# EAGLE board hh2019_proto (EAGLE 9.2.2)
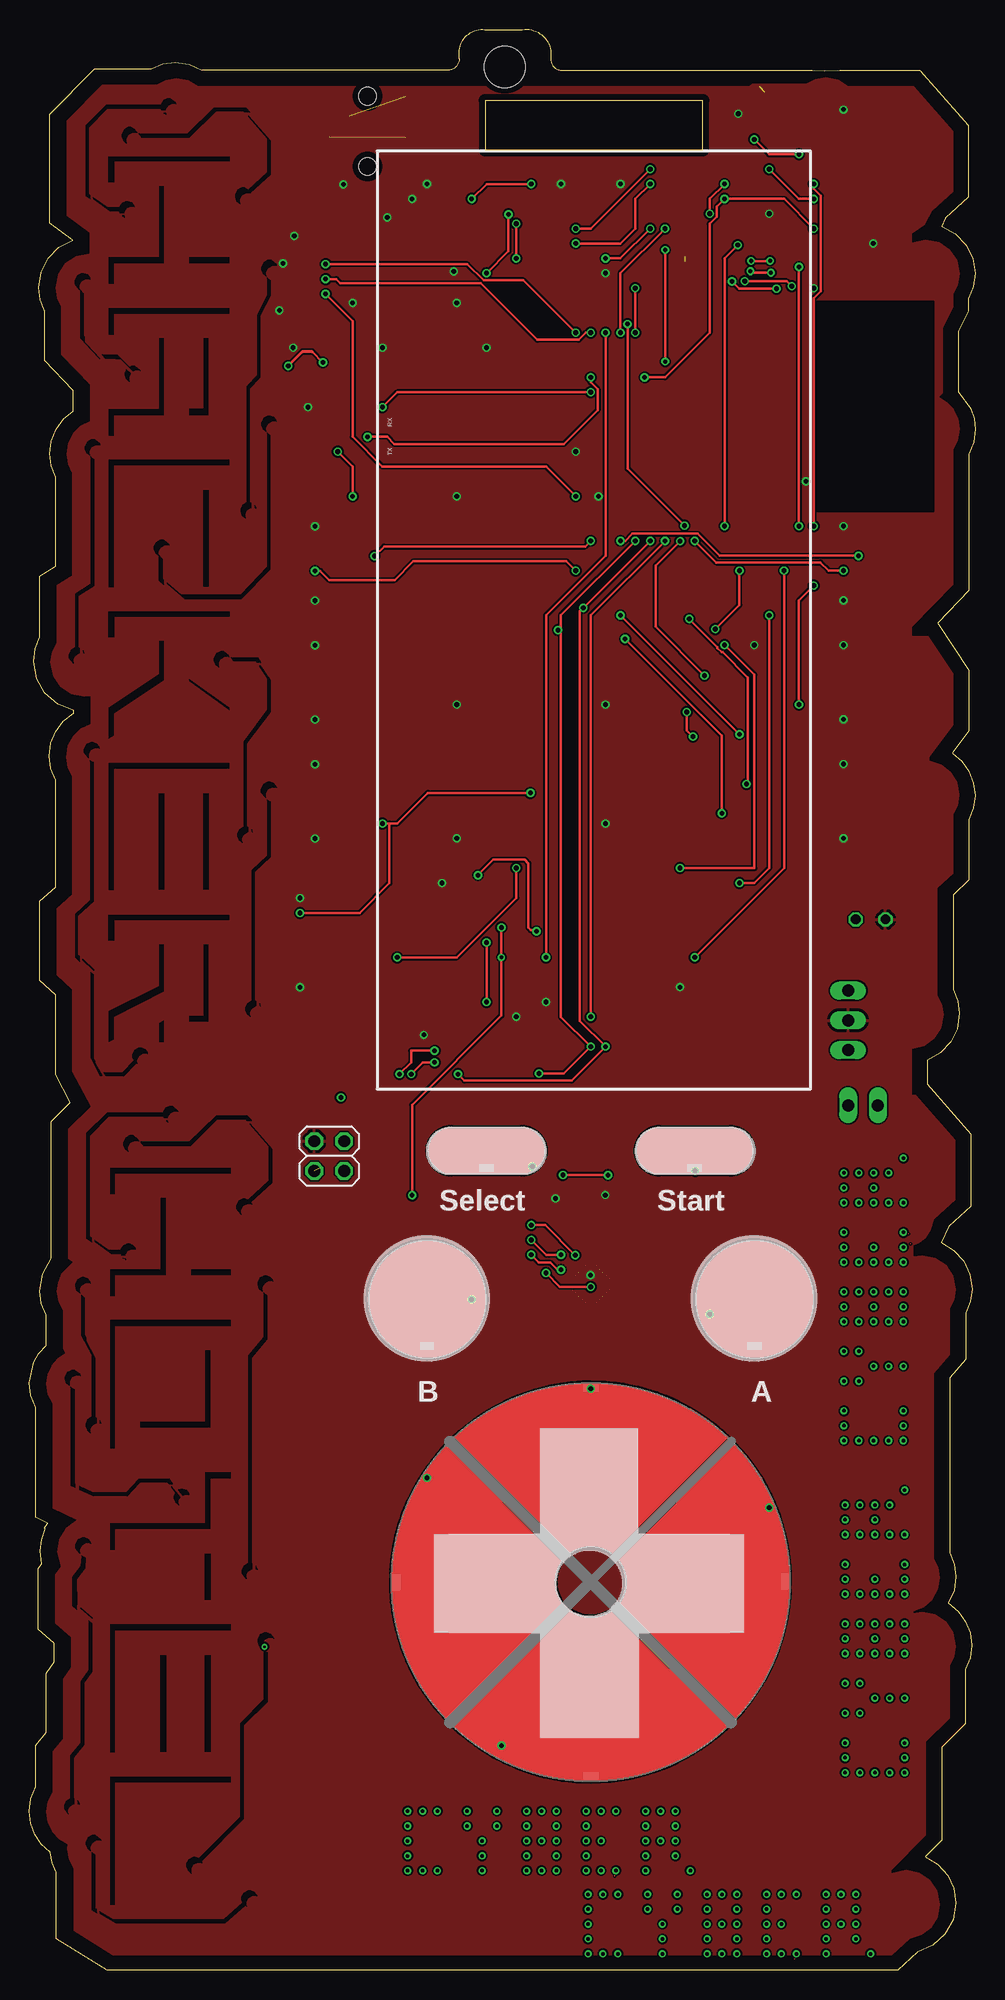
[diagram p3: board, top side]
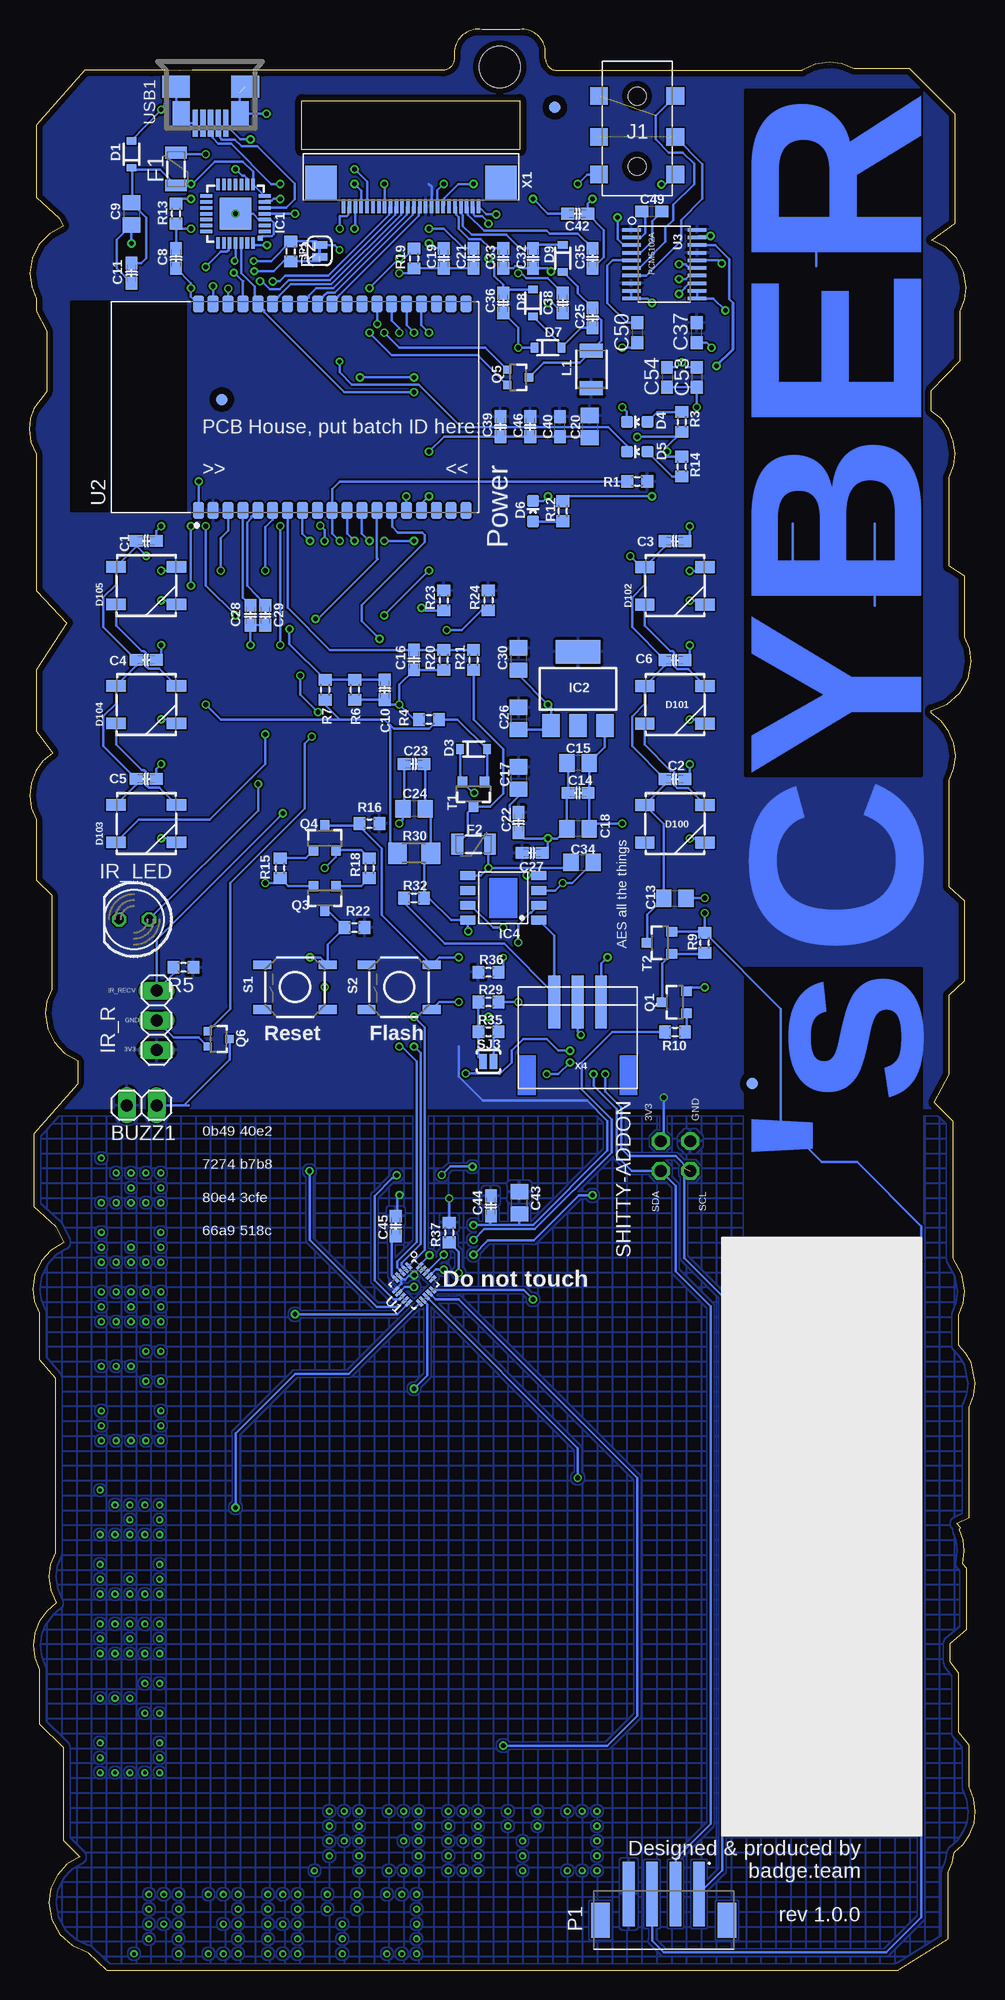
[diagram p4: board, bottom side, seen from below]

Size 80.77 x 165.74 mm. Coordinates in mm from the lower left corner, seen from the top.
Outline: 178 segments
Copper layers (1*16): Top 0.035mm / dielectric 1.6mm / Bottom 0.035mm
Design rules "Elecrow_2-layer_PCB_eagle_rule": minimum track width 6mil, minimum drill 12mil, track to track 6mil, track to pad 6mil, pad to pad 6mil, via to via 8mil, smd to smd 0mil, copper to edge 20mil, drill to drill 10mil, minimum pad ring 6mil, minimum via ring 6mil, stop-mask expansion 0mil, vias tented up to drill 100mil, thermal gap 10mil
Net classes: 1 FAT: width 0.2 mm, drill 0.4 mm; 2 GND/3V3: width 0.2 mm, drill 0.4 mm; 3 Touch: width 0.2 mm, clearance 1 mm; 4 touch prox: width 0.2 mm, clearance 1.6 mm
Holes 3.5 mm at 40.6,162.52
tRestrict: area 67.2,124.6 to 77.2,142.5; area 11.1,92.3 to 11.5,100.5; area 4.8,151.3 to 12.5,159.8; area 7.9,156 to 9.2,157.4; area 9.4,156.5 to 18.8,159.1; area 17.6,150.9 to 20.6,158.3; area 6.8,152.7 to 17.1,154.9; area 6.8,144.1 to 11.5,152.3; area 5.5,150.1 to 9,151.4; area 13.7,145.8 to 17.1,146.2; area 6.8,139.7 to 17.1,141.9; area 3.9,143.5 to 5.2,144.9; 69 more areas; 63 lines
bRestrict: area 67.4,124.6 to 77.2,142.5

## Footprints (pad centres in the part's own frame; a part is rotated, then mirrored left to right if it is on the bottom)
1X02 = drill 1.016 long: 1 -1.27,0; 2 1.27,0
C0603-DASHES = smd 1.1 x 1: 1 -0.85,0; 2 0.85,0
C0805 = smd 1.3 x 1.5: 1 -0.95,0; 2 0.95,0
C0603 = smd 1.1 x 1: 1 -0.85,0; 2 0.85,0
SOD-323 = smd 0.63 x 0.83: A 1.15,0; C -1.15,0
LED-0603 = smd 1 x 1: A 0,-0.877; C 0,0.877
WS2812B = smd 1.651 x 1: 1 -2.577,1.6; 2 -2.577,-1.6; 3 2.577,-1.6; 4 2.577,1.6
PTC-1206 = smd 1 x 1.8: 1 -1.4,0; 2 1.4,0
FIDUCIAL_1MM = smd 1 x 1: 1 0,0
MLP28 = smd 1 x 0.3: 1 -2.5,1.5; 2 -2.5,1; 3 -2.5,0.5; 4 -2.5,0; 5 -2.5,-0.5; 6 -2.5,-1; 7 -2.5,-1.5; 15 2.5,-1.5; 16 2.5,-1; 17 2.5,-0.5; 18 2.5,0; 19 2.5,0.5; 20 2.5,1; 21 2.5,1.5 | smd 0.3 x 1: 8 -1.5,-2.5; 9 -1,-2.5; 10 -0.5,-2.5; 11 0,-2.5; 12 0.5,-2.5; 13 1,-2.5; 14 1.5,-2.5; 22 1.5,2.5; 23 1,2.5; 24 0.5,2.5; 25 0,2.5; 26 -0.5,2.5; 27 -1,2.5; 28 -1.5,2.5 | smd 2.7 x 2.7: EXP 0,0 | smd 0.435 x 0.435: M -2.103,2.103
SOT223 = smd 1.5 x 2: 1 -2.3,-3.15; 2 0,-3.15; 3 2.3,-3.15 | smd 3.8 x 2: 4 0,3.15
SOP-8 = smd 1.27 x 0.76: 1 -3.035,1.905; 2 -3.035,0.635; 3 -3.035,-0.635; 4 -3.035,-1.905; 5 3.035,-1.905; 6 3.035,-0.635; 7 3.035,0.635; 8 3.035,1.905
LED5MM = drill 0.813 octagon: A -1.27,0; K 1.27,0
1X03 = drill 1.016 long: 1 -2.54,0; 2 0,0; 3 2.54,0
PJ-313D = smd 1.5 x 1.5: 2_1 0,3.25; 2_2 0,-3.25; 3_1 3.2,3.25; 3_2 3.22,-3.25; 4_1 6.7,3.25; 4_2 6.7,-3.25 | hole 1.5: 0.7,0; 6.7,0
SMT-JUMPER_2_NC_TRACE_SILK = smd 0.635 x 1.27: 1 -0.508,0; 2 0.508,0
1210 = smd 1.2 x 2: 1 -1.6,0; 2 1.6,0
JST_B4B-PH-SM4-TB = smd 1 x 5.5: 1 -3,0; 2 -1,0; 3 1,0; 4 3,0 | smd 1.6 x 3: P1 -5.4,2.25; P2 5.4,2.25
SOT23-3 = smd 0.8 x 0.9: 1 -0.95,-1; 2 0.95,-1; 3 0,1.1
SOT323 = smd 0.7 x 0.7: 1 -0.65,-0.925; 2 0.65,-0.925; 3 0,0.925
R0603-DASHES = smd 1 x 1.1: 1 -0.85,0; 2 0.85,0
R1206 = smd 1.6 x 1.803: 1 -1.422,0; 2 1.422,0
TACTILE-SWITCH-SMD = smd 1.524 x 0.762: 1 -2.794,1.905; 2 2.794,1.905; 3 -2.794,-1.905; 4 2.794,-1.905
2X02 = drill 1.016 octagon: 1 -1.27,-1.27; 2 -1.27,1.27; 3 1.27,-1.27; 4 1.27,1.27
PAD-JUMPER-2-NO_YES_SILK = smd 0.635 x 1.27: 1 -0.45,0; 2 0.45,0
TOUCH_BUTTON = smd 1.27 x 0.635: P$1 0,-4
TOUCH_CROSS = smd 1.27 x 0.635: D 0.03,-16.57; UP 0.02,16.6 | smd 0.635 x 1.27: L -16.59,-0.02; R 16.6,0.06
TOUCH_SELECT = smd 1.27 x 0.635: P$1 0,-1.5
QFN40P300X300X60-20N = smd 0.711 x 0.254: 1 -1.448,0.787; 2 -1.448,0.406; 3 -1.448,0; 4 -1.448,-0.406; 5 -1.448,-0.787; 11 1.448,-0.787; 12 1.448,-0.406; 13 1.448,0; 14 1.448,0.406; 15 1.448,0.787 | smd 0.254 x 0.711: 6 -0.787,-1.448; 7 -0.406,-1.448; 8 0,-1.448; 9 0.406,-1.448; 10 0.787,-1.448; 16 0.787,1.448; 17 0.406,1.448; 18 0,1.448; 19 -0.406,1.448; 20 -0.787,1.448
XCVR_ESP32-WROVER-I = smd 1.45 x 0.93: 1 -8.81,8.26; 2 -8.81,6.99; 3 -8.81,5.72; 4 -8.81,4.45; 5 -8.81,3.18; 6 -8.81,1.91; 7 -8.81,0.64; 8 -8.81,-0.63; 9 -8.81,-1.9; 10 -8.81,-3.17; 11 -8.81,-4.44; 12 -8.81,-5.71; 13 -8.81,-6.98; 14 -8.81,-8.25; 15 -8.81,-9.52; 16 -8.81,-10.79; 17 -8.81,-12.06; 18 -8.81,-13.33; 19 -8.81,-14.6; 20 8.81,-14.6; 21 8.81,-13.33; 22 8.81,-12.06; 23 8.81,-10.79; 24 8.81,-9.52; 25 8.81,-8.25; 26 8.81,-6.98; 27 8.81,-5.71; 28 8.81,-4.44; 29 8.81,-3.17; 30 8.81,-1.9; 31 8.81,-0.63; 32 8.81,0.64; 33 8.81,1.91; 34 8.81,3.18; 35 8.81,4.45; 36 8.81,5.72; 37 8.81,6.99; 38 8.81,8.26
PCM5102A = smd 0.3 x 1.6: P$1 -2.925,-2.8; P$2 -2.275,-2.8; P$3 -1.625,-2.8; P$4 -0.975,-2.8; P$5 -0.325,-2.8; P$6 0.325,-2.8; P$7 0.975,-2.8; P$8 1.625,-2.8; P$9 2.275,-2.8; P$10 2.925,-2.8; P$11 2.925,2.8; P$12 2.275,2.8; P$13 1.625,2.8; P$14 0.975,2.8; P$15 0.325,2.8; P$16 -0.325,2.8; P$17 -0.975,2.8; P$18 -1.625,2.8; P$19 -2.275,2.8; P$20 -2.927,2.8
MOLEX-47364-0001 = smd 2.3 x 0.45: 1 3.1,1.3; 2 3.1,0.65; 3 3.1,0; 4 3.1,-0.65; 5 3.1,-1.3 | smd 1.9 x 2.375: GND1 0,2.95; GND4 0,-2.95 | smd 2.1 x 1.475: GND2 2.3,2.5; GND3 2.3,-2.5
68712414022 = smd 0.3 x 1.2: 1 -5.75,0.6; 2 -5.25,0.6; 3 -4.75,0.6; 4 -4.25,0.6; 5 -3.75,0.6; 6 -3.25,0.6; 7 -2.75,0.6; 8 -2.25,0.6; 9 -1.75,0.6; 10 -1.25,0.6; 11 -0.75,0.6; 12 -0.25,0.6; 13 0.25,0.6; 14 0.75,0.6; 15 1.25,0.6; 16 1.75,0.6; 17 2.25,0.6; 18 2.75,0.6; 19 3.25,0.6; 20 3.75,0.6; 21 4.25,0.6; 22 4.75,0.6; 23 5.25,0.6; 24 5.75,0.6 | smd 2.7 x 3: 25 -7.68,-1.38; 26 7.68,-1.38
JST-PH3 = smd 1 x 4.5: 1 2,0; 2 0,0; 3 -2,0

## Placement (x,y rotation side)
BUZZ1  [1X02]  71.18,73.86 180 bottom
C1  100n  [C0603-DASHES]  70.79,122.05 180 bottom
C2  100n  [C0603-DASHES]  25.66,101.71 180 bottom
C3  100n  [C0603-DASHES]  25.66,122.03 180 bottom
C4  100n  [C0603-DASHES]  70.79,111.89 180 bottom
C5  100n  [C0603-DASHES]  70.79,101.73 180 bottom
C6  100n  [C0603-DASHES]  25.66,111.87 180 bottom
C8  100n  [C0603-DASHES]  68.25,146.18 270 bottom
C9  4u7/16V  [C0805]  72.06,149.99 270 bottom
C10  100n  [C0603-DASHES]  50.44,109.34 270 bottom
C11  100n  [C0603-DASHES]  72.06,144.91 270 bottom
C13  4u7/16V  [C0805]  25.66,91.55 0 bottom
C14  100n  [C0603-DASHES]  33.93,100.54 180 bottom
C15  4u7/16V  [C0805]  33.93,103.08 180 bottom
C16  100n  [C0603-DASHES]  47.93,111.89 270 bottom
C17  4u7/16V  [C0805]  39.01,101.81 270 bottom
C18  4u7/16V  [C0805]  33.93,97.46 180 bottom
C19  1u  [C0603-DASHES]  45.39,146.18 90 bottom
C20  4u7/16V  [C0805]  32.93,131.81 270 bottom
C21  1u  [C0603-DASHES]  42.85,146.18 90 bottom
C22  100n  [C0603-DASHES]  39.01,98 270 bottom
C23  100n  [C0603-DASHES]  47.93,103 0 bottom
C24  4u7/16V  [C0805]  47.93,99.19 180 bottom
C25  1u  [C0603-DASHES]  32.69,141.1 90 bottom
C26  4u7/16V  [C0805]  39.01,106.89 270 bottom
C27  100n  [C0603-DASHES]  37.85,95.41 0 bottom
C28  100n  [C0603-DASHES]  61.9,115.7 90 bottom
C29  100n  [C0603-DASHES]  60.63,115.7 90 bottom
C30  4u7/16V  [C0805]  39.01,111.97 270 bottom
C32  1u  [C0603-DASHES]  37.77,146.18 90 bottom
C33  1u  [C0603-DASHES]  40.31,146.18 90 bottom
C34  4u7/16V  [C0805]  33.59,94.61 0 bottom
C35  1u  [C0603-DASHES]  32.69,146.18 90 bottom
C36  1u  [C0603-DASHES]  40.31,142.37 90 bottom
C37  100n  [C0603]  23.8,139.83 90 bottom
C38  1u  [C0603-DASHES]  35.23,142.37 90 bottom
C39  1u  [C0603-DASHES]  40.55,131.81 270 bottom
C40  1u  [C0603]  35.47,131.81 90 bottom
C42  1u  [C0603-DASHES]  33.96,149.99 0 bottom
C43  4u7/16V  [C0805]  38.94,65.52 90 bottom
C44  100n  [C0603-DASHES]  41.37,65.27 90 bottom
C45  100n  [C0603-DASHES]  49.5,63.54 90 bottom
C46  1u  [C0603-DASHES]  38.01,131.81 270 bottom
C49  1u  [C0603]  27.64,150.19 0 bottom
C50  1u  [C0603]  28.88,139.83 270 bottom
C53  1u  [C0603]  23.8,136.02 270 bottom
C54  100n  [C0603]  26.34,136.02 270 bottom
D1  SD05-7  [SOD-323]  72.06,155.07 90 bottom
D3  NSVR0320MW2T1G  [SOD-323]  42.85,104.27 0 bottom
D4  Yellow  [LED-0603]  28.88,132.21 90 bottom
D5  RED  [LED-0603]  28.88,129.67 90 bottom
D6  green  [LED-0603]  37.77,124.59 0 bottom
D7  NSVR0320MW2T1G  [SOD-323]  36.5,138.56 0 bottom
D8  NSVR0320MW2T1G  [SOD-323]  37.77,142.37 90 bottom
D9  NSVR0320MW2T1G  [SOD-323]  35.23,146.18 270 bottom
D100  SK6812  [WS2812B]  25.66,97.9 0 bottom
D101  SK6812  [WS2812B]  25.66,108.06 0 bottom
D102  SK6812  [WS2812B]  25.66,118.22 0 bottom
D103  SK6812  [WS2812B]  70.79,97.92 0 bottom
D104  SK6812  [WS2812B]  70.79,108.08 0 bottom
D105  SK6812  [WS2812B]  70.79,118.24 0 bottom
F1  1A  [PTC-1206]  68.25,153.8 270 bottom
F2  1A  [PTC-1206]  42.85,96.15 180 bottom
FD1  FIDUCIAL  [FIDUCIAL_1MM]  19.04,75.71 0 bottom
FD4  FIDUCIAL  [FIDUCIAL_1MM]  64.34,134.13 0 bottom
FD5  FIDUCIAL  [FIDUCIAL_1MM]  35.91,159.08 0 bottom
IC1  CP210X_USB_UART  [MLP28]  63.17,149.99 180 bottom
IC2  AP2114H  [SOT223]  33.93,109.43 0 bottom
IC4  TP4056  [SOP-8]  40.31,91.57 180 bottom
IR_LED  [LED5MM]  71.83,89.73 180 bottom
IR_R  [1X03]  69.91,81.11 270 bottom
J1  PJ-313D  [PJ-313D]  28.88,153.33 90 bottom
JP1  JUMPER-SMT_2_NC_TRACE_SILK  [SMT-JUMPER_2_NC_TRACE_SILK]  55.99,146.82 90 bottom
L1  47µ  [1210]  32.8,136.68 90 bottom
P1  B4B-PH-SM4-TB  [JST_B4B-PH-SM4-TB]  26.6,6.52 180 bottom
Q1  MMBT2222A  [SOT23-3]  25.66,82.66 90 bottom
Q3  MMBT2222A  [SOT23-3]  55.55,91.57 180 bottom
Q4  MMBT2222A  [SOT23-3]  55.55,96.65 0 bottom
Q5  SI1304 BDL  [SOT323]  39.04,136.02 270 bottom
Q6  SI1304 BDL  [SOT323]  64.6,79.52 270 bottom
R1  100k  [R0603-DASHES]  28.88,127.13 0 bottom
R2  10k  [R0603-DASHES]  58.46,146.78 270 bottom
R3  1k  [R0603-DASHES]  25.07,132.21 270 bottom
R4  10k  [R0603-DASHES]  46.66,106.81 0 bottom
R5  10k  [R0603-DASHES]  67.61,85.64 180 bottom
R6  100k  [R0603-DASHES]  52.98,109.34 90 bottom
R7  220k  [R0603-DASHES]  55.52,109.34 270 bottom
R9  10k  [R0603-DASHES]  23.12,87.74 90 bottom
R10  10k  [R0603-DASHES]  25.66,80.12 0 bottom
R12  1k  [R0603-DASHES]  35.23,124.59 90 bottom
R13  10k  [R0603-DASHES]  68.25,149.99 90 bottom
R14  1k  [R0603-DASHES]  25.07,128.4 90 bottom
R15  10k  [R0603-DASHES]  59.36,94.11 90 bottom
R16  10k  [R0603-DASHES]  51.74,97.92 0 bottom
R18  10k  [R0603-DASHES]  51.74,94.11 270 bottom
R19  2R7  [R0603-DASHES]  47.93,146.18 270 bottom
R20  100k  [R0603-DASHES]  45.39,111.89 90 bottom
R21  220k  [R0603-DASHES]  42.85,111.89 270 bottom
R22  10k  [R0603-DASHES]  53.01,89.03 180 bottom
R23  4k7  [R0603-DASHES]  45.39,116.97 270 bottom
R24  4k7  [R0603-DASHES]  41.58,116.97 270 bottom
R29  1.2k  [R0603-DASHES]  41.58,82.68 180 bottom
R30  0R27 1/4W  [R1206]  47.93,95.38 0 bottom
R32  10k  [R0603-DASHES]  47.93,91.57 0 bottom
R35  1.2k  [R0603-DASHES]  41.58,80.14 0 bottom
R36  100k  [R0603-DASHES]  41.58,85.22 180 bottom
R37  75k 1%  [R0603-DASHES]  44.92,62.99 270 bottom
S1  SWITCH-MOMENTARY-2SMD  [TACTILE-SWITCH-SMD]  58.09,83.95 180 bottom
S2  SWITCH-MOMENTARY-2SMD  [TACTILE-SWITCH-SMD]  49.2,83.95 180 bottom
SHITTY-ADDON  [2X02]  25.6,69.52 270 top
SJ3  JUMPER-PAD-2-NOYES_SILK  [PAD-JUMPER-2-NO_YES_SILK]  41.58,77.6 180 bottom
T1  [SOT23-3]  42.85,100.46 180 bottom
T2  [SOT23-3]  26.93,87.74 90 bottom
TOUCH_A  TOUCHROUND  [TOUCH_BUTTON]  33.96,57.28 0 top
TOUCH_B  TOUCHROUND  [TOUCH_BUTTON]  61.9,57.28 0 top
TOUCH_SEL  TOUCH_CROSS  [TOUCH_CROSS]  47.93,33.15 0 top
TOUCH_SELECT  TOUCHSELECT  [TOUCH_SELECT]  56.82,69.98 0 top
TOUCH_START  TOUCHSELECT  [TOUCH_SELECT]  39.04,69.98 0 top
U1  MPR121QR2  [QFN40P300X300X60-20N]  47.93,58.55 315 bottom
U2  ESP32-WROVER-I  [XCVR_ESP32-WROVER-I]  58.09,133.48 90 bottom
U3  PCM5102A  [PCM5102A]  26.57,145.68 270 bottom
USB1  MOLEX-47346-0001  [MOLEX-47364-0001]  65.3,160.83 270 bottom
X1  [68712414022]  48.19,151.23 180 bottom
X4  JST-PH3  [JST-PH3]  33.96,82.68 180 bottom

## Tracks (layer width: path | path; a pad name or v marks a point on that pad's centre or on a via)
3V3  (via drill 0.4)  (1 unrouted)
  Top 0.2: v46.62,61.05 44.04,63.63 v42.85,63.63
  Bottom 0.2: U1.20 47.46,60.21 v46.62,61.05 | v42.85,63.63 41.58,63.63 | 41.58,63.63 39.04,63.63 | 39.04,63.63 37.77,63.63 31.42,69.98 31.42,72.52 33.16,74.26 42.05,74.26 44.12,76.33 44.12,78.87 | X1.9 46.44,152.31 46.66,152.53 | C44.1 41.37,63.84 41.58,63.63 | C43.1 38.94,63.73 39.04,63.63 | SHITTY-ADDON.2 26.6,71.06 v26.6,74.52 | 13.6,149.52 13.6,145.52 | 8.6,123.52 8.6,116.52 | 15.6,123.52 15.6,117.52
  pour Bottom: 85.92,167.2 -5,167.2 -5,73.64 85.92,73.64
+5V  (via drill 0.4)
  Top 0.2: v65.71,108.08 65.71,116.97 v66.98,118.24 | v66.98,123.32 66.98,142.79 67.58,143.39 67.58,151.51 66.98,152.12 v66.98,152.53
  Bottom 0.2: T1.1 41.7,101.66 D3.A 44.24,106.81 R4.2 46.61,106.01 49.66,106.01 49.97,106.31 | IC1.7 IC1.8 61.67,153.57 62.54,154.44 64.94,154.44 66.91,152.47 v66.98,152.53 67.11,152.4 F1.2 69.58,153.74 71.87,153.74 72,153.86 | R30.1 49.97,96 49.97,106.31 | 49.97,106.31 50.47,106.81 54.28,106.81 | 54.28,106.81 64.44,106.81 v65.71,108.08 | v66.98,118.24 v66.98,123.32 | R7.2 55.52,108.05 54.28,106.81 | D1.C 72,153.86 | 72,153.86 72,151 C9.1 70.79,149.67 70.79,146.18 71.21,145.76 C11.1
AUDIO_L  (1 unrouted)
  Bottom 0.2: U3.P$6 28.71,145.36 26.48,147.59 26.48,148.78 25.82,149.44 25.82,150.74 24.03,152.53 24.03,154.26 24.99,155.22 26.19,155.22 27.31,156.34 27.31,158.35 J1.4_2
AUDIO_R  (1 unrouted)
  Bottom 0.2: J1.3_2 23.32,154.24 23.32,151.26 25.13,149.45 25.13,147.67 28.1,144.71 U3.P$7
BAT  (via drill 0.4)
  Top 0.2: v31.42,86.49 36.5,86.49 41.58,91.57 v41.58,94.11
  Bottom 0.2: v31.42,86.49 31.96,85.95 X4.3 | F2.1 41.58,96.02 v41.58,94.11 | C34.1 35.04,94.11 v41.58,94.11 | v41.58,94.11 42.21,93.48 IC4.5
BUZZ_OUT
  Bottom 0.2: 67.17,73.86 67.6,73.86 | 67.6,73.86 63.68,77.78 Q6.3 | 67.6,73.86 BUZZ1.1
BUZZER  (via drill 0.4)
  Top 0.2: v56.66,105.34 56.13,105.87 v56.13,107.44 | v57.64,110.56 53.46,114.74 53.46,119.94 v55.56,122.04 | v55.94,123.35 51.07,128.22 v51.07,140.57
  Bottom 0.2: v56.66,105.34 56.68,105.34 57.27,104.75 57.27,99.18 63.62,92.82 63.62,82.6 63.62,82.08 Q6.1 65.53,80.48 | v56.13,107.44 57.64,108.95 v57.64,110.56 | v55.56,122.04 55.56,122.98 v55.94,123.35 | v51.07,140.57 51.07,142.26 U2.26
CAPM
  Bottom 0.2: C49.2 27.61,149.37 27.61,147.64 28.61,146.64 28.62,146.66 U3.P$4
CAPP
  Bottom 0.2: C49.1 28.21,149.91 28.21,148.34 28.59,147.96 U3.P$2
CE  (via drill 0.4)
  Top 0.2: v38.3,93.51 39.62,94.82 42.3,94.82 42.6,94.52 42.6,89.02 42.8,88.82 43.2,88.82 v43.3,88.72
  Bottom 0.2: C23.2 46.98,102.9 C24.1 46.5,98.72 R30.2 47.08,94.81 R32.2 46.66,91.57 44.75,89.67 IC4.8 43.34,88.76 v43.3,88.72 | IC4.4 38.27,93.48 v38.3,93.51
CHRG_STAT  (via drill 0.3, 0.4)  (1 unrouted)
  Top 0.2: v45.39,59.82 45.09,59.82 44.47,60.44 43.5,60.44 v42.85,61.09 | v40.31,89.03 v40.31,86.49 40.31,81.52 32.69,73.9 v32.69,66.17
  Bottom 0.2: U1.17 46.08,59.82 v45.39,59.82 | IC4.7 43.08,90.94 41.18,89.03 v40.31,89.03 | v32.69,66.17 33.86,66.17 37.72,62.31 41.63,62.31 v42.85,61.09 | R36.1 40.31,85.64 v40.31,86.49
ELE0  (via drill 0.4)  (1 unrouted)
  Top 0.2: v42.94,68.62 42.85,68.71 39.27,68.71 TOUCH_START.P$1 | v49.4,67.9 v45.56,67.9 v45.55,67.91
  Bottom 0.2: U1.8 49.2,57.28 49.68,57.28 51.28,58.89 51.28,66.14 49.78,67.65 49.66,67.65 v49.4,67.9 | v45.55,67.91 44.84,68.62 v42.94,68.62
ELE1  (via drill 0.4)  (1 unrouted)
  Top 0.2: v56.85,68.25 56.82,68.28 TOUCH_SELECT.P$1
  Bottom 0.2: U1.9 49.26,56.64 51.1,56.64 56.82,62.36 56.82,68.22 v56.85,68.25
ELE2  (via drill 0.4)  (1 unrouted)
  Top 0.2: v58.09,56.01 59.17,56.01 TOUCH_B.P$1
  Bottom 0.2: U1.10 49.35,56.01 v58.09,56.01
ELE3  (via drill 0.4)  (1 unrouted)
  Top 0.2: v63.17,39.5 61.9,38.23 61.9,35.84 TOUCH_SEL.R
  Bottom 0.2: U1.11 53.5,50.93 58.09,50.93 63.17,45.85 v63.17,39.5
ELE4  (via drill 0.4)  (1 unrouted)
  Top 0.2: v47.93,49.66 47.95,49.68 TOUCH_SEL.UP
  Bottom 0.2: U1.12 46.81,56.86 46.81,50.78 v47.93,49.66
ELE5  (via drill 0.4)  (1 unrouted)
  Top 0.2: TOUCH_SEL.L 31.4,33.13 35.23,36.96 35.23,40.77 v33.96,42.04
  Bottom 0.2: U1.13 33.96,44.58 v33.96,42.04
ELE6  (via drill 0.4)  (1 unrouted)
  Top 0.2: v40.31,19.18 45.36,19.18 TOUCH_SEL.D
  Bottom 0.2: U1.14 46.08,57.28 44.12,57.28 28.88,42.04 28.88,21.72 31.42,19.18 v40.31,19.18
ELE7  (via drill 0.4)  (1 unrouted)
  Top 0.2: v37.77,57.28 33.96,53.47 TOUCH_A.P$1
  Bottom 0.2: U1.15 38.57,58.09 v37.77,57.28
ESP32_!RESET  (via drill 0.4)
  Top 0.2: v56.82,86.49 64.44,94.11 v64.44,119.51
  Bottom 0.2: v56.82,86.49 55.93,86.49 S1.3 55.29,87.6 R22.2 55.3,90.47 Q3.3 | v64.44,119.51 64.44,122.31 63.81,122.94 U2.3
ESP32_FLASH  (via drill 0.4)
  Top 0.2: v44.12,86.49 44.12,115.7 49.2,120.78 v49.2,139.83
  Bottom 0.2: v49.2,139.83 49.2,140.23 49.84,140.87 U2.25 | v44.12,86.49 45.77,86.49 S2.3 50.67,90.12 50.67,95.8 52.59,97.72 R16.1 52.76,97.75 Q4.3
ESP32_RX  (via drill 0.4)
  Top 0.2: v47.93,134.75 31.42,134.75 v30.15,133.48
  Bottom 0.2: IC1.26 62.67,144.9 61.51,143.74 61.51,142.53 U2.34 60.71,141.74 60.71,141.6 53.87,134.75 v47.93,134.75 | v30.15,133.48 29.75,133.09 D4.C
ESP32_TX  (via drill 0.35)
  Top 0.2: v61.62,145.96 63.23,145.96 v63.25,145.97 | v54.29,146.9 v54.29,137.37
  Bottom 0.2: v61.62,145.96 60.13,145.96 R2.1 56.3,147.63 JP1.2 54.71,147.32 v54.29,146.9 | v63.25,145.97 63.17,146.05 IC1.25 | v54.29,137.37 54.29,136.46 53.23,135.4 47.52,135.4 43.91,131.79 31.34,131.79 29.75,130.2 D5.C
ESP32_TX_PRE  (via drill 0.35)  (1 unrouted)
  Top 0.2: v63.31,144.96 61.69,144.96 v61.56,145.09
  Bottom 0.2: 62.51,144.24 62.54,144.21 | 62.54,144.21 U2.35 | 62.54,144.21 63.28,144.96 v63.31,144.96 | v61.56,145.09 59.89,145.09 59.05,145.93 R2.2 55.99,145.93 55.61,146.31
GDR  (via drill 0.4)
  Top 0.2: v54.28,148.72 50.47,144.91 v50.47,139.83
  Bottom 0.2: v54.28,148.72 54.28,149.79 54.2,149.79 54.19,149.78 53.68,149.78 53.53,149.93 53.53,150.53 X1.23 | v50.47,139.83 49.2,138.56 41.85,138.56 Q5.1
GND  (via drill 0.4)  (3 unrouted)
  Bottom 0.2: USB1.5 67.8,157.73 USB1.GND3 68.25,158.53 USB1.GND4 69.05,160.03 69.36,158.88 v69.52,158.88 D1.A | U1.6 49.01,58.59 49.01,59.06 U1.4 49.2,59.29 48.89,58.98 48.68,58.98 48.38,59.29 47.98,59.29 47.93,59.34 | C45.2 49.36,64.52 49.36,66 v49.17,66.19 | 48.25,59.34 47.93,59.34 | 47.93,59.34 v47.91,59.34 | IC1.EXP 61.67,149.99 61.17,149.49 IC1.3 60.16,149.49 59.91,149.25 59.91,148.24 60.06,148.09 60.86,148.09 IC1.M | v33.69,79.87 33.96,80.14 X4.2 | v44.12,82.68 45.77,82.68 S2.1 | S1.1 55.55,82.3 v55.55,83.95 | 62.8,160.38 USB1.GND2 60.54,158.53 v60.53,158.54 | U2.38 66.98,142.92 v66.98,143.64 66.98,144.06 C8.2 | IC4.3 35.86,92.21 v35.23,92.84 34.41,92.84 C34.2 | Q1.2 24.34,83.93 v23.12,83.93 | C13.2 v23.12,91.55 | D101.3 23.41,106.79 v24.39,106.79 | D100.3 23.41,96.63 v24.39,96.63 | D102.3 23.41,116.95 v24.39,116.95 | D103.3 68.54,96.65 v69.52,96.65 | D104.3 68.54,106.81 v69.52,106.81 | D105.3 68.54,116.97 v69.52,116.97 | C1.1 69.94,122.9 v69.52,123.32 | C4.1 69.52,112.31 v69.52,113.16 | C5.1 69.94,102.58 v69.52,103 | C2.1 24.39,102.13 v24.39,102.98 | C3.1 24.39,122.45 v24.39,123.3 | C6.1 24.39,112.29 v24.39,113.14 | 29.5,143.28 U3.P$9 U3.P$10 27.99,142.76 v27.61,142.37 | v21.35,141.74 22.37,142.76 U3.P$11 U3.P$12 | U3.P$19 23.63,148.09 v22.62,148.09 | C29.1 C28.1 v61.9,113.16 | C26.2 36.57,105.94 IC2.1 36.23,107.81 v36.5,108.08 39.01,110.59 C30.2 | C27.2 36.5,95.91 v36.5,96.65 | v36.5,96.65 38.51,96.65 C22.2 39.01,97.45 39.76,98.2 39.76,99.51 39.01,100.26 C17.2 | v36.5,96.65 35.69,96.65 C18.2 34.88,100.44 C14.2 34.78,102.98 C15.2 | X1.17 50.44,152.5 v50.47,152.53 | X1.8 45.94,151.98 v45.39,152.53
  Bottom 0.2: C21.1 C19.1 R19.2 48.35,144.91 v49.2,144.91 | C33.1 39.47,145.33 39.29,145.52 38.79,145.52 38.6,145.33 C32.1 36.51,145.33 v36.24,145.06 | C23.1 48.78,99.29 C24.2 48.88,98.24 v49.2,97.92 | C38.1 36.08,142.37 v36.5,142.37 | D7.C v39.04,138.56 39.04,140.25 C36.1 | U2.1 66.31,124.71 v66.31,127.13 | U3.P$16 21.9,146.01 v21.65,145.76 | SJ3.1 41.13,79.74 R35.2 40.73,80.56 v41.58,81.41 | C35.1 31.72,146.3 31.72,148.6 C42.2 33.11,150.84 v32.69,151.26 | R20.1 C16.2 49.2,109.77 v49.2,108.08 | R6.1 C10.2 50.03,108.08 v49.2,108.08 | U2.15 48.59,124.7 v48.59,125.86 | C50.2 29.3,138.56 v30.15,138.56 | C54.2 C53.2 v23.8,133.48 | C11.2 73.33,145.33 73.33,147.77 C9.2 v72.06,147.45 | D6.C 36.89,125.47 v36.5,125.86 | v22.53,138.56 22.95,138.98 C37.1 | J1.2_2 26.46,152.49 v26.81,152.49 | J1.2_1 33.16,153.33 v33.96,152.53 | R4.1 47.93,106.81 v49.2,108.08 | U3.P$3 30.02,147.31 30.56,147.84 v30.56,149.67 | C20.2 32.83,130.96 C40.1 C46.2 C39.2 45.37,130.96 v46.66,129.67 | R37.1 44.92,65.9 v44.93,65.91 | IR_R.2 68.46,79.67 66.32,79.67 Q6.2
  other vias: 63.17,149.99
  pour Bottom (hatched): 85.58,72.95 -4.67,72.95 -4.67,-2.27 85.58,-2.27
  pour Top: 1.59,14.4 1.44,13.51 1.58,12.63 1.96,11.86 2.54,11.23 3.29,10.8 3.25,10.33 3.4,9.45 3.79,8.67 3.79,3.4 7.12,1.34 73.62,1.34 75.17,2.75 76.19,3.05 77,3.69 77.54,4.58 77.74,5.64 77.51,6.76 76.89,7.68 75.97,8.3 74.85,8.53 73.59,8.24 73.59,8.6 76.55,11.56 76.55,19.54 78.57,21.57 78.57,26.01 78.96,26.79 79.11,27.67 78.88,28.79 78.26,29.71 77.34,30.33 76.22,30.56 75.46,30.45 75.46,30.67 76.37,31.04 77.09,31.68 77.57,32.52 77.74,33.52 77.59,34.41 77.2,35.19 77.2,51.01 78.57,52.6 78.57,56.46 78.96,57.24 79.11,58.12 78.88,59.25 78.26,60.17 77.34,60.79 76.22,61.01 75.46,60.91 75.46,61.95 75.98,62.14 76.52,62.59 76.97,63.27 77.27,64.19 79.04,65.82 79.04,70.84 75.68,74.71 75.32,74.71 75.32,78.72 76.39,78.98 77.26,79.6 77.85,80.51 78.06,81.61 77.92,82.49 77.52,83.27 77.52,92.44 78.86,93.71 78.86,98.69 79.25,99.47 79.4,100.35 79.2,101.4 78.66,102.29 77.85,102.92 76.84,103.24 76.84,103.64 78.86,106.35 78.86,110.69 76.76,113.9 75.32,113.9 75.32,114.73 78.86,118.38 78.86,129.87 79.28,130.67 79.44,131.6 79.3,132.48 78.92,133.25 78.34,133.88 77.6,134.31 77.99,134.71 77.99,140.27 78.86,142.01 78.86,143.13 79.28,143.92 79.44,144.86 79.21,145.98 78.59,146.9 77.67,147.52 76.55,147.75 75.32,147.46 75.32,148.33 76.43,149.09 77.09,150.28 78.86,151.9 78.86,157 75.5,160.83 69.94,160.83 69.06,161.38 67.99,161.58 67.1,161.44 66.32,161.04 61.7,161.04 61.48,160.83 14.41,160.83 13.56,161.33 12.54,161.51 11.65,161.36 10.87,160.97 6.25,160.97 3.18,157.9 3.18,149.88 5.17,148.44 5.17,146.56 5.13,146.56 4.01,146.33 3.09,145.71 2.47,144.79 2.24,143.67 2.37,142.8 2.75,142.04 2.75,138 5.2,135.43 5.2,132.25 4.38,131.85 3.74,131.21 3.33,130.4 3.18,129.47 3.31,128.6 3.68,127.84 3.68,119.07 2.35,118.24 2.35,113.36 1.96,112.58 1.81,111.7 2.03,110.57 2.66,109.66 3.57,109.03 4.7,108.81 5.24,108.84 5.24,106.39 4.41,105.98 3.74,105.35 3.3,104.54 3.14,103.6 3.29,102.72 3.68,101.94 3.68,91.83 2.35,90.6 2.35,85.04 3.68,83.77 3.68,76.76 5.27,73.73 3.32,71.78 3.32,60.8 3.79,60.47 2.75,59.42 2.45,58.72 2.35,57.94 2.5,57.06 2.89,56.28 2.89,53.07 3.11,52.67 2.44,52.22 1.91,51.61 1.57,50.88 1.44,50.07 1.59,49.18 1.99,48.41 1.99,39.48 4.15,38.44 3.14,37.71 3.11,37.68 3.11,37.64 2.57,36.77 2.38,35.73 2.71,34.43 2.2,33.78 2.2,29.66 3.58,28.47 3.58,25.83 2.89,24.85 2.89,19.72 1.99,18.64 1.99,15.17
I2C_INT  (via drill 0.4)  (1 unrouted)
  Top 0.2: v47.93,81.41 47.93,115.7 v54.28,122.05
  Bottom 0.2: U1.1 47.01,61.52 47.01,80.49 v47.93,81.41 | v54.28,122.05 54.92,122.69 U2.10 54.92,126.49 54.28,127.13 R1.1
I2C_SCL  (via drill 0.4)  (2 unrouted)
  Top 0.2: v51.74,122.05 45.39,115.7 45.39,114.68 v45.13,114.43 45.39,114.18 45.39,81.41 v47.93,78.87 45.64,76.58 v43.51,76.58 | v34.6,78.52 32.6,78.52 32.6,77.52 v31.6,76.52
  Bottom 0.2: U2.12 52.38,122.69 v51.74,122.05 | U1.2 48.99,60.19 48.99,60.4 47.36,62.03 47.36,78.3 v47.93,78.87 | R24.2 42.17,116.12 43.86,114.43 v45.13,114.43 | v43.51,76.58 40.66,76.58 40.6,76.52 39.6,77.52 39.6,78.52 38.6,79.52 36.6,79.52 35.6,78.52 v34.6,78.52 | v31.6,76.52 31.6,75.02 30.25,73.67 30.25,70.17 29.6,69.52 25.6,69.52 SHITTY-ADDON.3 | 24.86,68.52 24.86,60.83 21.6,57.58 21.6,8.52 P1.1
I2C_SDA  (via drill 0.4)  (1 unrouted)
  Top 0.2: v53.01,122.05 v47.29,116.34 47.01,116.05 47.01,81.06 v49.2,78.87 46.3,75.98 37.15,75.98 v36.6,76.52 | v34.6,77.52 33.6,77.52 v32.6,76.52
  Bottom 0.2: U2.11 53.65,122.69 v53.01,122.05 | U1.3 48.95,59.61 49.34,60 49.34,60.55 47.71,62.17 47.71,77.6 48.98,78.87 v49.2,78.87 | R23.2 47.08,116.12 v47.29,116.34 | v36.6,76.52 35.6,76.52 v34.6,77.52 | v32.6,76.52 32.6,75.52 30.6,73.52 30.6,69.52 29.33,68.25 SHITTY-ADDON.4 25.6,66.98 25.6,59.68 22.6,56.68 22.6,12.52 25.6,9.52 P1.2
I2S_SCK  (via drill 0.4)
  Top 0.2: v46.66,125.86 44.12,128.4 30.15,128.4 27.61,130.94 27.61,140.83 v25.3,143.14
  Bottom 0.2: U2.16 47.3,125.22 v46.66,125.86 | v25.3,143.14 24.82,143.62 24.82,143.66 24.42,144.06 U3.P$13
I2S_SD  (via drill 0.4)
  Top 0.2: v47.93,139.83 47.51,139.83 46.91,139.23 43.37,139.23 38.54,144.06 26.57,144.06 26.21,144.41 v25.3,144.41
  Bottom 0.2: U2.24 48.57,140.47 v47.93,139.83 | v25.3,144.41 24.72,144.41 24.67,144.46 24.45,144.68 23.79,144.68 U3.P$14
I2S_WS  (via drill 0.4)
  Top 0.2: v46.66,139.83 42.18,144.31 38.79,144.31 37.41,145.68 v25.3,145.68
  Bottom 0.2: U2.23 47.3,140.47 v46.66,139.83 | v25.3,145.68 24.75,145.68 24.67,145.61 24.45,145.38 23.79,145.38 U3.P$15
IR_RECV  (via drill 0.4)
  Top 0.2: v50.87,113.68 59.13,105.42 v59.13,98.79
  Bottom 0.2: U2.14 49.81,124.64 49.81,123.28 49.3,122.78 47.24,122.78 47.02,122.55 47.02,121.94 52.37,116.58 52.37,115.19 v50.87,113.68 | v59.13,98.79 69.91,88.01 IR_R.1 68.46,85.1 R5.2
IR_SEND  (via drill 0.4)
  Top 0.2: v56.35,115.4 58.75,112.99 58.75,112.91 59.11,112.56 59.18,112.56 61.34,110.4 61.34,101.44 61.24,101.34 v61.24,101.28
  Bottom 0.2: U2.13 51.11,120.58 51.04,120.51 56.15,115.4 v56.35,115.4 | v61.24,101.28 61.24,99.05 IR_LED.A
LCD_!RESET  (via drill 0.4)
  Top 0.2: v61.08,144.23 64.66,144.23 v65.09,143.8
  Bottom 0.2: X1.15 49.53,150.53 49.53,149.93 55.12,144.34 58.62,144.34 59.4,143.56 60.27,143.56 60.94,144.23 v61.08,144.23 | v65.09,143.8 65.09,142.3 U2.37
LCD_BUSY  (via drill 0.4)
  Top 0.2: v59.99,144.22 60.6,143.61 63.77,143.61 v63.79,143.59
  Bottom 0.2: X1.16 50.03,150.53 50.03,149.92 55.24,144.72 58.91,144.72 59.4,144.22 v59.99,144.22 | v63.79,143.59 63.79,142.31 U2.36
LCD_CS
  Bottom 0.2: U2.31 56.9,142.85 56.9,142.99 56.27,143.62 54.84,143.62 48.53,149.93 48.53,150.53 X1.13
LCD_D/!S
  Bottom 0.2: X1.14 49.03,150.53 49.03,149.93 54.99,143.97 58.46,143.97 59.44,142.99 U2.33
LCD_MOSI
  Bottom 0.2: X1.11 47.53,150.53 47.53,149.82 54.36,142.99 U2.29
LCD_SCK
  Bottom 0.2: X1.12 48.03,150.53 48.03,149.93 54.69,143.27 55.35,143.27 55.63,142.99 U2.30
LCD_VDD  (via drill 0.4)
  Top 0.2: v42.85,152.53 39.04,152.53 v37.77,151.26
  Bottom 0.2: X1.7 45.34,150.73 45.34,151.34 44.14,152.53 v42.85,152.53 | v37.77,151.26 36.5,149.99 C42.1
LDO0  (via drill 0.4)
  Top 0.2: v25.07,137.29 24.15,138.21
  Top 0.254: 24.15,138.21 23.31,138.21 v22.11,137
  Bottom 0.2: U3.P$18 22.19,147.31 21.01,146.12 21.01,142.68 20.71,142.39 | C54.1 25.49,136.87 v25.07,137.29 24.65,136.87 C53.1
  Bottom 0.254: v22.11,137 20.71,138.4 20.71,142.39
N$1  (via drill 0.3)
  other vias: 37.38,12.31
N$2
  Bottom 0.2: D101.2 28.23,104.66 26.04,102.46 25.85,102.46 25.7,102.32 25.7,101.2 25.46,100.96 24.54,100.96 D100.4
N$3
  Bottom 0.2: D104.2 73.36,104.68 71.17,102.48 70.98,102.48 70.83,102.34 70.83,101.22 70.59,100.98 69.67,100.98 D103.4
N$4
  Bottom 0.2: D105.2 73.36,114.84 71.17,112.64 70.98,112.64 70.83,112.5 70.83,111.38 70.59,111.14 69.67,111.14 D104.4
N$6
  Top 0.001: 49.97,8.03 49.97,8.1
N$7
  Top 0.001: 75.25,62.03 75.21,62.03
N$8  (via drill 0.3)
  other vias: 38.65,11.04
N$9
  Bottom 0.2: R29.2 R35.1 42.43,78 SJ3.2
N$10  (via drill 0.4)
  Top 0.2: v65.71,145.44 v65.71,123.32 | v63.17,115.7 63.17,94.11 61.9,92.84 v60.63,92.84
  Bottom 0.2: Q3.2 58.67,92.57 R15.1 59.78,92.84 v60.63,92.84 | v65.71,145.44 v65.71,145.45 64.42,146.74 63.91,146.74 63.76,146.89 63.76,147.39 IC1.24 | v65.71,123.32 65.71,118.24 v63.17,115.7
N$11  (via drill 0.4)
  Top 0.2: v55.55,94.11 61.9,94.11 61.9,110.62 v59.36,113.16 | v59.36,123.32 59.36,146.18 v60.49,147.32
  Bottom 0.2: R18.1 52.43,95.65 Q4.2 54.6,95.06 v55.55,94.11 | v59.36,113.16 v59.36,123.32 | IC1.28 61.49,147.32 v60.49,147.32
N$12  (via drill 0.3)
  other vias: 39.92,12.31
N$13
  Bottom 0.2: Q4.1 57.19,94.96 R15.2
N$14
  Bottom 0.2: Q3.1 52.43,92.57 R18.2
N$15  (via drill 0.3)
  other vias: 38.65,9.77
N$16  (via drill 0.3)
  other vias: 38.65,8.5
N$17  (via drill 0.3)
  other vias: 32.3,12.31
N$18  (via drill 0.3)
  other vias: 32.3,11.04
N$19
  Bottom 0.2: D102.2 28.23,114.82 26.04,112.62 25.85,112.62 25.7,112.48 25.7,111.36 25.46,111.12 24.54,111.12 D101.4
N$20  (1 unrouted)
  Bottom 0.2: U1.5 49.83,59.35 49.83,62.36 C45.1
N$21  (via drill 0.4)  (1 unrouted)
  Top 0.2: v47.93,58.35 45.3,58.35 v44.12,59.54
  Bottom 0.2: U1.7 48.7,58.35 v47.93,58.35 | v44.12,59.54 44.12,61.34 R37.2
N$22
  Bottom 0.2: D8.C 35.35,138.8 D7.A 33.66,140.25 C25.1
N$23
  Bottom 0.2: D9.A 33.96,143.76 33.96,143.22 C25.2 32.69,141.66 31.93,140.91 31.93,139.14 L1.2 33.79,137.29 36.84,137.29 Q5.3
N$24  (via drill 0.3)
  other vias: 32.3,9.77
N$25  (via drill 0.3)
  other vias: 32.3,8.5
N$26
  Bottom 0.2: D6.A 35.25,123.72 R12.1
N$27
  Bottom 0.2: D4.A 27.15,133.06 R3.1
N$28
  Bottom 0.2: D5.A 25.88,127.55 R14.1
N$32  (via drill 0.4)
  Top 0.2: v61.9,156.34 63.17,155.07 v65.71,155.07
  Bottom 0.2: USB1.1 63.79,157.52 63.79,157.38 62.75,156.34 v61.9,156.34 | v65.71,155.07 68.12,155.07 F1.1
N$42
  Bottom 0.2: U2.4 62.54,117.19 C28.2
N$43
  Bottom 0.2: U2.5 61.82,124.12 61.82,123.98 62.18,123.61 62.18,118.24 61.3,117.35 61.29,117.35 60.63,116.69 C29.2
N$44  (via drill 0.3)
  other vias: 33.57,8.5
N$45  (via drill 0.3)
  other vias: 34.84,8.5
N$46  (via drill 0.3)
  other vias: 42.46,12.31
N$47  (via drill 0.3)
  other vias: 42.46,11.04
N$48  (via drill 0.3)
  other vias: 42.46,9.77
N$49  (via drill 0.3)
  other vias: 42.46,8.5
N$50  (via drill 0.4)
  Top 0.2: v24.39,119.49 24.85,119.49 25.63,118.71 31.19,118.71 32.79,120.31 45.86,120.31 v46.66,119.51 | v50.47,115.7 v60.63,105.54
  Bottom 0.2: D102.4 23.41,119.49 v24.39,119.49 | v46.66,119.51 v50.47,115.7 | v60.63,105.54 60.63,103 65.39,98.24 71.45,98.24 D103.2
N$51  (via drill 0.3)
  other vias: 43.73,8.5
N$52
  Bottom 0.2: Q1.1 24.66,80.27 R10.2
N$53
  Bottom 0.2: Q1.3 26.76,85.96 T2.1 23.22,86.79 R9.1
N$54  (via drill 0.3)
  other vias: 45,8.5
N$55  (via drill 0.3)
  other vias: 45,9.77
N$56  (via drill 0.3)
  other vias: 45,11.04
N$57  (via drill 0.3)
  other vias: 45,12.31
N$58  (via drill 0.3)
  other vias: 37.38,13.58
N$59  (via drill 0.3)
  other vias: 39.92,13.58
N$60  (via drill 0.3)
  other vias: 42.46,13.58
N$61  (via drill 0.3)
  other vias: 43.73,13.58
N$62  (via drill 0.3)
  other vias: 45,13.58
N$63  (via drill 0.3)
  other vias: 43.73,11.04
N$64  (via drill 0.3)
  other vias: 34.84,13.58
N$65  (via drill 0.3)
  other vias: 33.57,13.58
N$66  (via drill 0.3)
  other vias: 32.3,13.58
N$67  (via drill 0.3)
  other vias: 47.54,13.58
N$68  (via drill 0.3)
  other vias: 48.81,13.58
N$69  (via drill 0.3)
  other vias: 50.08,13.58
N$70  (via drill 0.3)
  other vias: 47.54,12.31
N$71  (via drill 0.3)
  other vias: 47.54,11.04
N$72  (via drill 0.3)
  other vias: 47.54,9.77
N$73  (via drill 0.3)
  other vias: 47.54,8.5
N$74  (via drill 0.3)
  other vias: 48.81,8.5
N$75  (via drill 0.3)
  other vias: 50.08,8.5
N$76  (via drill 0.3)
  other vias: 48.81,11.04
N$77  (via drill 0.3)
  other vias: 52.62,13.58
N$78  (via drill 0.3)
  other vias: 52.62,12.31
N$79  (via drill 0.3)
  other vias: 52.62,11.04
N$80  (via drill 0.3)
  other vias: 52.62,9.77
N$81  (via drill 0.2)
  other vias: 20.08,27.62
N$82  (via drill 0.3)
  other vias: 52.62,8.5
N$83  (via drill 0.3)
  other vias: 53.89,13.58
N$84  (via drill 0.3)
  other vias: 55.16,13.58
N$85  (via drill 0.3)
  other vias: 55.16,12.31
N$86  (via drill 0.3)
  other vias: 53.89,11.04
N$87  (via drill 0.3)
  other vias: 55.16,11.04
N$88  (via drill 0.3)
  other vias: 55.16,9.77
N$89  (via drill 0.3)
  other vias: 56.43,8.5
N$90
  Top 0.001: 65.37,0.93 65.37,1
N$91  (via drill 0.3)
  other vias: 52.78,5.21
N$92  (via drill 0.3)
  other vias: 54.05,3.94
N$93  (via drill 0.3)
  other vias: 55.32,5.21
N$94  (via drill 0.3)
  other vias: 54.05,2.67
N$95  (via drill 0.3)
  other vias: 54.05,1.4
N$96  (via drill 0.3)
  other vias: 47.7,5.21
N$97  (via drill 0.3)
  other vias: 47.7,3.94
N$98  (via drill 0.3)
  other vias: 47.7,2.67
N$99  (via drill 0.3)
  other vias: 47.7,1.4
N$100  (via drill 0.3)
  other vias: 48.97,1.4
N$101  (via drill 0.3)
  other vias: 50.24,1.4
N$102  (via drill 0.3)
  other vias: 57.86,5.21
N$103  (via drill 0.3)
  other vias: 57.86,3.94
N$104  (via drill 0.3)
  other vias: 57.86,2.67
N$105  (via drill 0.3)
  other vias: 57.86,1.4
N$106  (via drill 0.3)
  other vias: 59.13,1.4
N$107  (via drill 0.3)
  other vias: 60.4,1.4
N$108  (via drill 0.3)
  other vias: 60.4,2.67
N$109  (via drill 0.3)
  other vias: 60.4,3.94
N$110  (via drill 0.3)
  other vias: 60.4,5.21
N$111  (via drill 0.3)
  other vias: 52.78,6.48
N$112  (via drill 0.3)
  other vias: 55.32,6.48
N$113  (via drill 0.3)
  other vias: 57.86,6.48
N$114  (via drill 0.3)
  other vias: 59.13,6.48
N$115  (via drill 0.3)
  other vias: 60.4,6.48
N$116  (via drill 0.3)
  other vias: 59.13,3.94
N$117  (via drill 0.3)
  other vias: 50.24,6.48
N$118  (via drill 0.3)
  other vias: 48.97,6.48
N$119  (via drill 0.3)
  other vias: 47.7,6.48
N$120  (via drill 0.3)
  other vias: 62.94,6.48
N$121  (via drill 0.3)
  other vias: 64.21,6.48
N$122  (via drill 0.3)
  other vias: 65.48,6.48
N$123  (via drill 0.3)
  other vias: 62.94,5.21
N$124  (via drill 0.3)
  other vias: 62.94,3.94
N$125  (via drill 0.3)
  other vias: 62.94,2.67
N$126  (via drill 0.3)
  other vias: 62.94,1.4
N$127  (via drill 0.3)
  other vias: 64.21,1.4
N$128  (via drill 0.3)
  other vias: 65.48,1.4
N$129  (via drill 0.3)
  other vias: 64.21,3.94
N$130  (via drill 0.3)
  other vias: 68.02,6.48
N$131  (via drill 0.3)
  other vias: 68.02,5.21
N$132  (via drill 0.3)
  other vias: 68.02,3.94
N$133  (via drill 0.3)
  other vias: 68.02,2.67
N$134  (via drill 0.3)
  other vias: 68.02,1.4
N$135  (via drill 0.3)
  other vias: 69.29,6.48
N$136  (via drill 0.3)
  other vias: 70.56,6.48
N$137  (via drill 0.3)
  other vias: 70.56,5.21
N$138  (via drill 0.3)
  other vias: 69.29,3.94
N$139  (via drill 0.3)
  other vias: 70.56,3.94
N$140  (via drill 0.3)
  other vias: 70.91,21.96
N$141  (via drill 0.3)
  other vias: 70.56,2.67
N$142  (via drill 0.3)
  other vias: 72.18,23.23
N$143  (via drill 0.3)
  other vias: 70.91,24.5
N$144  (via drill 0.3)
  other vias: 73.45,23.23
N$145  (via drill 0.3)
  other vias: 74.72,23.23
N$146  (via drill 0.3)
  other vias: 70.91,16.88
N$147  (via drill 0.3)
  other vias: 72.18,16.88
N$148  (via drill 0.3)
  other vias: 73.45,16.88
N$149  (via drill 0.3)
  other vias: 74.72,16.88
N$150  (via drill 0.3)
  other vias: 74.72,18.15
N$151  (via drill 0.3)
  other vias: 74.72,19.42
N$152  (via drill 0.3)
  other vias: 70.91,27.04
N$153  (via drill 0.3)
  other vias: 72.18,27.04
N$154  (via drill 0.3)
  other vias: 73.45,27.04
N$155  (via drill 0.3)
  other vias: 74.72,27.04
N$156  (via drill 0.3)
  other vias: 74.72,28.31
N$157  (via drill 0.3)
  other vias: 74.72,29.58
N$158  (via drill 0.3)
  other vias: 73.45,29.58
N$159  (via drill 0.3)
  other vias: 72.18,29.58
N$160  (via drill 0.3)
  other vias: 70.91,29.58
N$161  (via drill 0.3)
  other vias: 69.64,21.96
N$162  (via drill 0.3)
  other vias: 69.64,24.5
N$163  (via drill 0.3)
  other vias: 69.64,27.04
N$164  (via drill 0.3)
  other vias: 69.64,28.31
N$165  (via drill 0.3)
  other vias: 69.64,29.58
N$166  (via drill 0.3)
  other vias: 72.18,28.31
N$167  (via drill 0.3)
  other vias: 69.64,19.42
N$168  (via drill 0.3)
  other vias: 69.64,18.15
N$169  (via drill 0.3)
  other vias: 69.64,16.88
N$170  (via drill 0.3)
  other vias: 69.64,32.12
N$171  (via drill 0.3)
  other vias: 69.64,33.39
N$172  (via drill 0.3)
  other vias: 69.64,34.66
N$173  (via drill 0.3)
  other vias: 70.91,32.12
N$174  (via drill 0.3)
  other vias: 72.18,32.12
N$175  (via drill 0.3)
  other vias: 73.45,32.12
N$176  (via drill 0.3)
  other vias: 74.72,32.12
N$177  (via drill 0.3)
  other vias: 74.72,33.39
N$178  (via drill 0.3)
  other vias: 74.72,34.66
N$179  (via drill 0.3)
  other vias: 72.18,33.39
N$180  (via drill 0.3)
  other vias: 69.64,37.2
N$181  (via drill 0.3)
  other vias: 70.91,37.2
N$182  (via drill 0.3)
  other vias: 72.18,37.2
N$183  (via drill 0.3)
  other vias: 73.45,37.2
N$184  (via drill 0.3)
  other vias: 74.72,37.2
N$185  (via drill 0.3)
  other vias: 69.64,38.47
N$186  (via drill 0.3)
  other vias: 69.64,39.74
N$187  (via drill 0.3)
  other vias: 70.91,39.74
N$188  (via drill 0.3)
  other vias: 72.18,38.47
N$189  (via drill 0.3)
  other vias: 72.18,39.74
N$190  (via drill 0.3)
  other vias: 73.45,39.74
N$191  (via drill 0.3)
  other vias: 74.72,41.01
N$192  (via drill 0.3)
  other vias: 71.83,1.4
N$193
  Top 0.001: 75.1,62.89 75.03,62.89
N$194  (via drill 0.3)
  other vias: 70.82,50.3
N$195  (via drill 0.3)
  other vias: 72.09,51.57
N$196  (via drill 0.3)
  other vias: 70.82,52.84
N$197  (via drill 0.3)
  other vias: 73.36,51.57
N$198  (via drill 0.3)
  other vias: 74.63,51.57
N$199  (via drill 0.3)
  other vias: 70.82,45.22
N$200  (via drill 0.3)
  other vias: 72.09,45.22
N$201  (via drill 0.3)
  other vias: 73.36,45.22
N$202  (via drill 0.3)
  other vias: 74.63,45.22
N$203  (via drill 0.3)
  other vias: 74.63,46.49
N$204  (via drill 0.3)
  other vias: 74.63,47.76
N$205  (via drill 0.3)
  other vias: 70.82,55.38
N$206  (via drill 0.3)
  other vias: 72.09,55.38
N$207  (via drill 0.3)
  other vias: 73.36,55.38
N$208  (via drill 0.3)
  other vias: 74.63,55.38
N$209  (via drill 0.3)
  other vias: 74.63,56.65
N$210  (via drill 0.3)
  other vias: 74.63,57.92
N$211  (via drill 0.3)
  other vias: 73.36,57.92
N$212  (via drill 0.3)
  other vias: 72.09,57.92
N$213  (via drill 0.3)
  other vias: 70.82,57.92
N$214  (via drill 0.3)
  other vias: 69.55,50.3
N$215  (via drill 0.3)
  other vias: 69.55,52.84
N$216  (via drill 0.3)
  other vias: 69.55,55.38
N$217  (via drill 0.3)
  other vias: 69.55,56.65
N$218  (via drill 0.3)
  other vias: 69.55,57.92
N$219  (via drill 0.3)
  other vias: 72.09,56.65
N$220  (via drill 0.3)
  other vias: 69.55,47.76
N$221  (via drill 0.3)
  other vias: 69.55,46.49
N$222  (via drill 0.3)
  other vias: 69.55,45.22
N$223  (via drill 0.3)
  other vias: 69.55,60.46
N$224  (via drill 0.3)
  other vias: 69.55,61.73
N$225  (via drill 0.3)
  other vias: 69.55,63
N$226  (via drill 0.3)
  other vias: 70.82,60.46
N$227  (via drill 0.3)
  other vias: 72.09,60.46
N$228  (via drill 0.3)
  other vias: 73.36,60.46
N$229  (via drill 0.3)
  other vias: 74.63,60.46
N$230  (via drill 0.3)
  other vias: 74.63,61.73
N$231  (via drill 0.3)
  other vias: 74.63,63
N$232  (via drill 0.3)
  other vias: 72.09,61.73
N$233  (via drill 0.3)
  other vias: 69.55,65.54
N$234  (via drill 0.3)
  other vias: 70.82,65.54
N$235  (via drill 0.3)
  other vias: 72.09,65.54
N$236  (via drill 0.3)
  other vias: 73.36,65.54
N$237  (via drill 0.3)
  other vias: 74.63,65.54
N$238  (via drill 0.3)
  other vias: 69.55,66.81
N$239  (via drill 0.3)
  other vias: 69.55,68.08
N$240  (via drill 0.3)
  other vias: 70.82,68.08
N$241  (via drill 0.3)
  other vias: 72.09,66.81
N$242  (via drill 0.3)
  other vias: 72.09,68.08
N$243  (via drill 0.3)
  other vias: 73.36,68.08
N$244  (via drill 0.3)
  other vias: 74.63,69.35
PREVGH
  Bottom 0.2: X1.4 43.94,150.02 43.76,149.85 43.76,148.94 43.01,148.19 40.05,148.19 38.9,147.03 C32.2 37.47,147.33 D9.C
PREVGL  (via drill 0.4)
  Top 0.2: v41.58,149.14 v41.58,146.18
  Bottom 0.2: v41.58,149.14 41.58,149.27 42.08,149.78 42.69,149.78 42.84,149.93 42.84,150.53 X1.2 | v41.58,146.18 41.06,145.66 41.06,144.68 40.31,143.93 C36.2 40.01,143.52 D8.A
PROG  (via drill 0.4)
  Top 0.2: v39.04,87.76 v39.04,82.68
  Bottom 0.2: IC4.2 37.91,90.3 38.01,90.3 39.04,89.27 v39.04,87.76 | v39.04,82.68 R29.1
RESE  (via drill 0.4)
  Top 0.2: v53.01,148.72 50.47,146.18 v49.2,146.18 | v51.74,139.83 v51.74,143.64
  Bottom 0.2: X1.22 52.94,148.79 v53.01,148.72 | R19.1 48.78,146.18 v49.2,146.18 v51.74,143.64 | Q5.2 42.5,137.91 49.82,137.91 v51.74,139.83
RST  (via drill 0.4)
  Top 0.2: v63.17,153.8 65.71,151.26 v66.98,151.26
  Bottom 0.2: v63.17,153.8 62.61,153.24 62.41,153.24 62.17,153 IC1.9 | v66.98,151.26 67.83,151.26 R13.2
TEMP
  Bottom 0.2: IC4.1 35.96,88.35 X4.1 35.96,83.38 40.24,87.66 45.29,87.66 48.78,91.15 R32.1
USB_DN_CON
  Bottom 0.2: USB1.2 64.47,157.56 64.47,156.48 64.33,156.33 63.24,156.33 62.65,155.74 61.29,155.74 58.13,152.58 58.13,151.22 58.86,150.49 IC1.5
USB_DP_CON  (via drill 0.4)
  Top 0.2: v58.09,149.99 58.09,151.26 v59.36,152.53
  Bottom 0.2: IC1.4 v58.09,149.99 | v59.36,152.53 60.1,152.53 63.54,155.98 64.62,155.98 65.12,156.48 65.12,157.56 USB1.3
VBAT
  Bottom 0.2: F2.2 43.34,97.06 43.34,98.87 T1.3 41.41,99.36 40.31,100.46 40.31,104.27 42.85,106.81 R21.2
VBAT_SENSE
  Bottom 0.2: R21.1 R20.2 C16.1 55.13,112.74 58.73,116.34 U2.7
VCC  (via drill 0.4)
  Top 0.2: v23.12,90.28 28.2,90.28 30.74,92.82 30.74,97.92 v30.15,97.92 31.42,97.92 34.03,100.54 v42.78,100.54
  Bottom 0.2: T2.2 23.22,88.69 R9.2 | D3.C 44,101.66 T1.2 42.87,100.54 v42.78,100.54 | R9.2 v23.12,90.28 | IC2.3 31.63,104.43 C15.1 32.98,100.64 C14.1 32.98,100.44 C18.1 32.52,97.92 v30.15,97.92 | P1.3 27.6,2.52 26.6,1.52 7.6,1.52 4.6,4.52 4.6,60.52 4.6,63.52 10.1,69.02 13.1,69.02 16.6,72.52 16.6,82.08 R9.2
VCOM  (via drill 0.4)
  Top 0.2: v40.91,149.94 40.91,146.78 v39.04,144.91
  Bottom 0.2: X1.1 41.75,149.94 v40.91,149.94 | v39.04,144.91 38.75,144.91 38.33,144.49 36.5,144.49 C38.2
VDD  (via drill 0.4)
  Top 0.2: v66.98,148.72 64.44,151.26 v59.36,151.26 58.69,150.6 58.69,149.74 58.09,149.14 58.09,139.83 54.28,136.02 v52.53,136.02 | v28.88,130.94 30.56,130.94 31.17,130.34 45.64,130.34 48.53,133.23 48.53,135 47.93,135.61 v47.93,136.02 | v26.34,129.67 27.61,128.4 v27.61,125.86
  Bottom 0.2: IC1.6 60.57,151.09 60.06,151.09 59.89,151.26 v59.36,151.26 | v66.98,148.72 67.83,148.72 R13.1 C8.1 | R14.2 26.34,129.25 v26.34,129.67 26.34,130.09 R3.2 25.49,130.94 v28.88,130.94 | v52.53,136.02 v47.93,136.02 | R12.2 34.81,125.86 v27.61,125.86
VGH  (via drill 0.4)
  Top 0.2: v53.01,153.8 47.93,148.72 v46.66,148.72
  Bottom 0.2: X1.20 51.94,152.73 v53.01,153.8 | v46.66,148.72 45.39,148.72 43.7,147.03 C21.2
VGL  (via drill 0.4)
  Top 0.2: v53.01,152.53 51.74,151.26 51.74,148.72 50.47,147.45 v46.66,147.45
  Bottom 0.2: X1.21 52.44,151.96 v53.01,152.53 | v46.66,147.45 46.24,147.03 C19.2
VNEG
  Bottom 0.2: U3.P$5 30.97,146.01 31.42,145.56 31.42,142.37 29.73,140.68 C50.1
VSH
  Bottom 0.2: X1.5 44.34,150.53 44.34,149.93 44.12,149.71 44.12,148.72 43.23,147.83 42.24,147.83 41.44,147.03 C33.2
VSL
  Bottom 0.2: X1.3 43.34,150.53 43.34,149.93 41.95,148.54 36.6,148.54 36.36,148.3 33.96,148.3 C35.2
VUSB_SENSE  (via drill 0.4)
  Top 0.2: v58.57,114.52 60.63,116.58 v60.63,119.51
  Bottom 0.2: C10.1 R6.2 R7.1 58.57,113.24 v58.57,114.52 | v60.63,119.51 60.63,123.22 60,123.85 U2.6
WS2812_DATA  (via drill 0.4)
  Top 0.2: v56.82,122.05 58.66,120.21 67.55,120.21 68.25,119.51 v69.52,119.51
  Bottom 0.2: U2.8 57.46,122.69 v56.82,122.05 | v69.52,119.51 68.54,119.51 D105.4
WS2812_POWER  (via drill 0.4)
  Top 0.2: v29.47,120.76 30.29,121.58 47.46,121.58 v47.93,122.05 | v50.47,122.05 50.88,122.05 51.49,122.66 57.07,122.66 58.94,120.78 v70.79,120.78
  Bottom 0.2: D102.1 28.23,118.3 29.31,117.23 29.31,114.68 C6.2 26.51,111.39 D101.1 28.23,108.14 29.31,107.07 29.31,104.52 C2.2 26.51,101.23 D100.1 26.61,97.88 C13.1 28.03,90.13 T2.3 | D102.1 26.51,121.55 C3.2 | D103.1 71.64,101.25 C5.2 74.44,104.54 74.44,107.09 73.36,108.16 D104.1 71.64,111.41 C4.2 74.44,114.7 74.44,117.25 73.36,118.32 D105.1 71.64,121.57 C1.2 71.64,121.63 v70.79,120.78 | D102.1 28.53,119.82 v29.47,120.76 | v47.93,122.05 v50.47,122.05
WS2812_POWER_EN  (via drill 0.4)  (1 unrouted)
  Top 0.2: v45.39,61.09 44.12,61.09 v42.85,62.36
  Bottom 0.2: U1.18 v45.39,61.09 | v45.39,61.09 | R10.1 31.01,80.12 33.6,77.52 33.6,75.21 31.06,72.67 31.06,69.84 37.62,63.28 41.93,63.28 v42.85,62.36

## Text on the board
Bottom: CYBER | 's
tNames: RX | TX | Select | Start | B | A
bNames: USB1 | F1 | PCB House, put batch ID here: / / >> << | Power | AES all the things | IR_RECV | GND | Flash | Reset | 3V3 | GND | 3V3 | SCL | SDA | 0b49 40e2 / 7274 b7b8 / 80e4 3cfe / 66a9 518c | Do not touch | Designed & produced by / badge.team | rev 1.0.0
bStop: CYBER | 's